# EAGLE board untitled (EAGLE 7.2.0), part 1 of 2
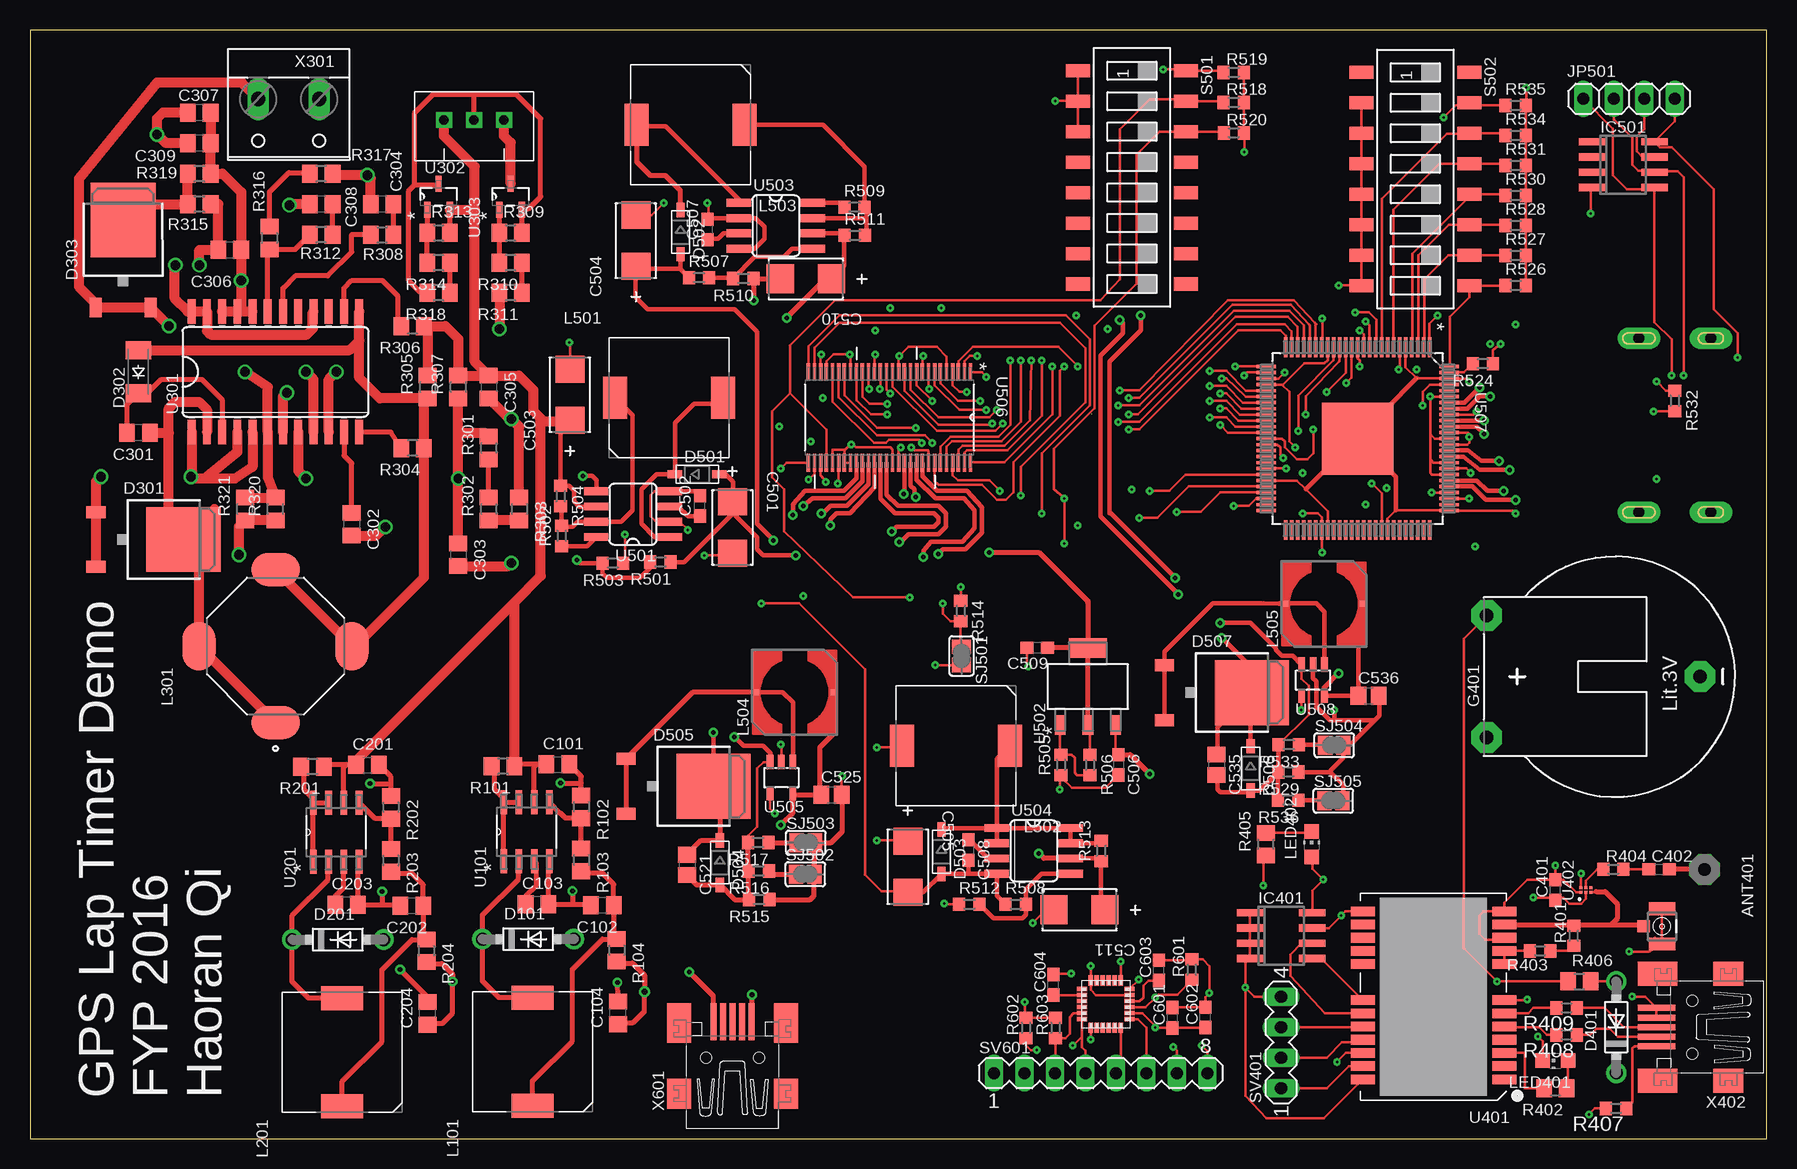
[diagram p8: board, top side]
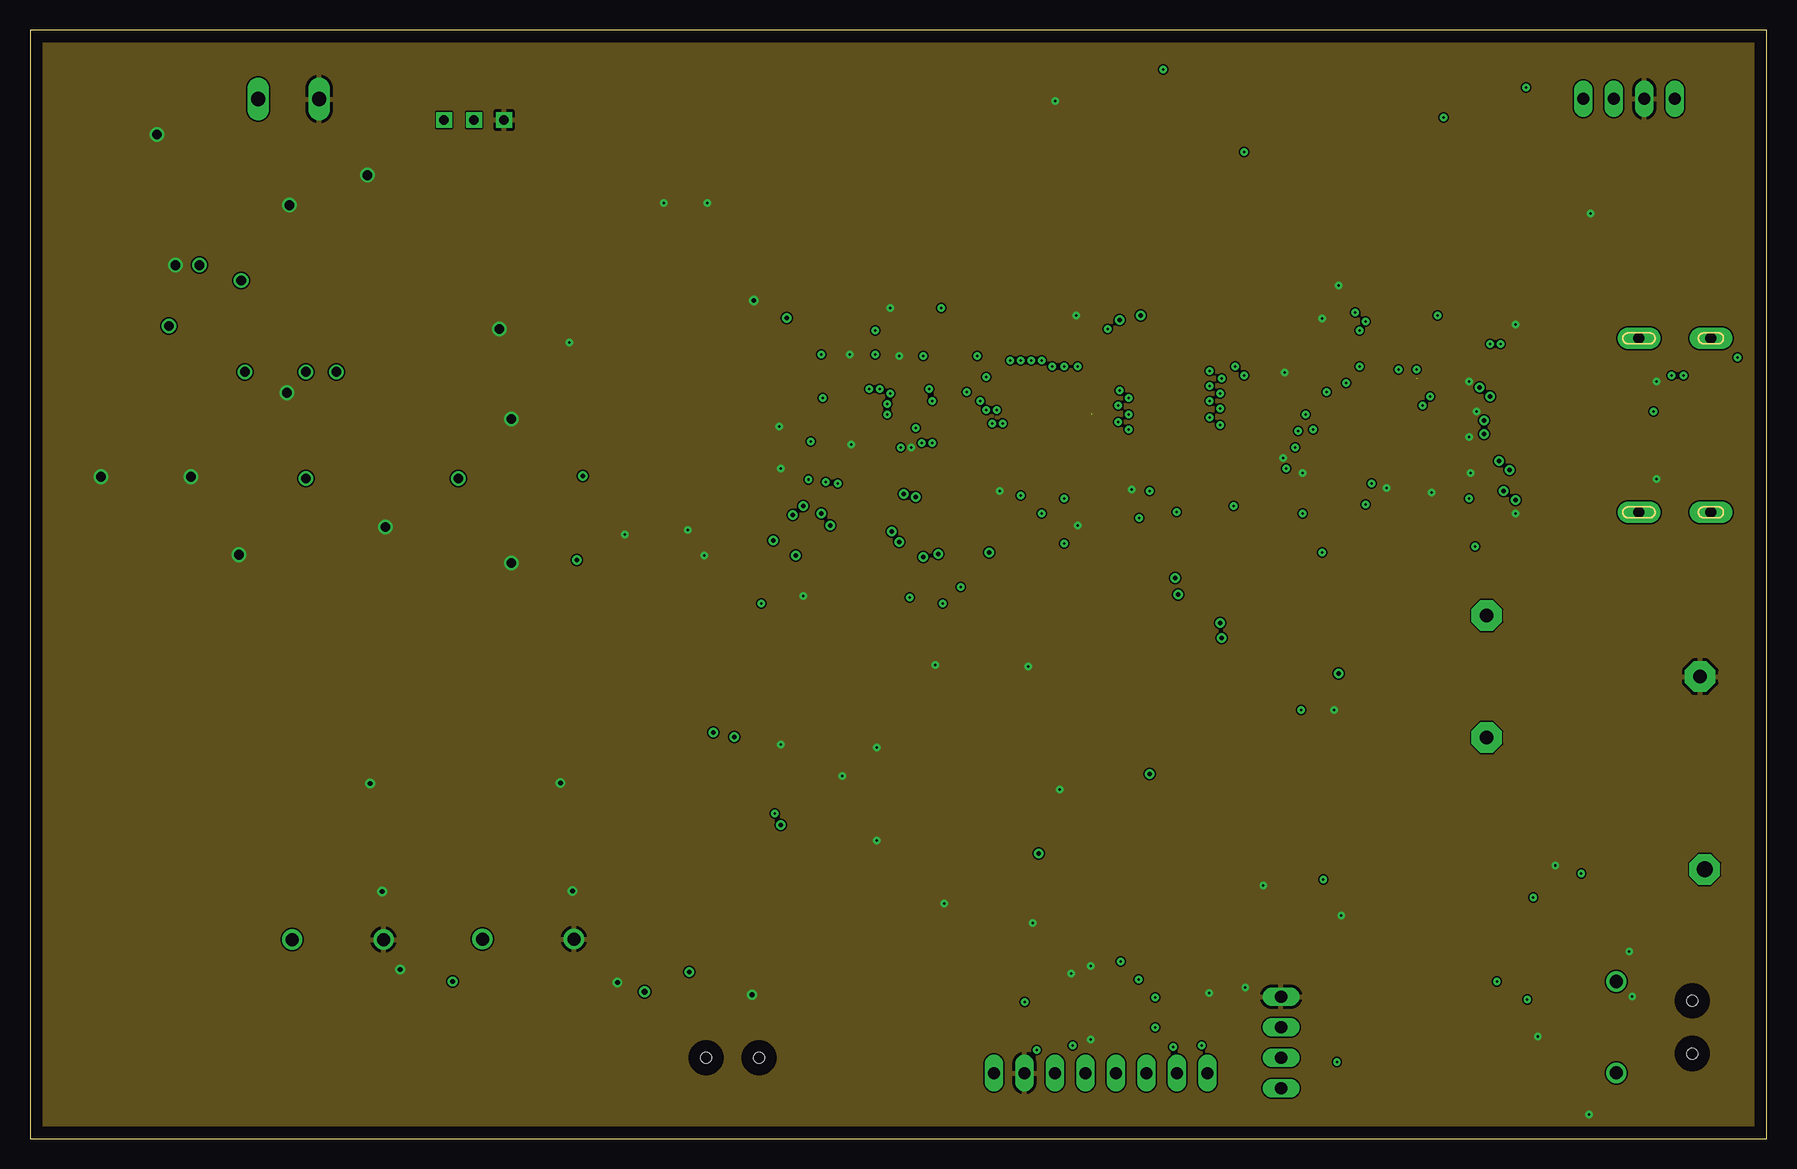
[diagram p9: board, inner layer Route2]
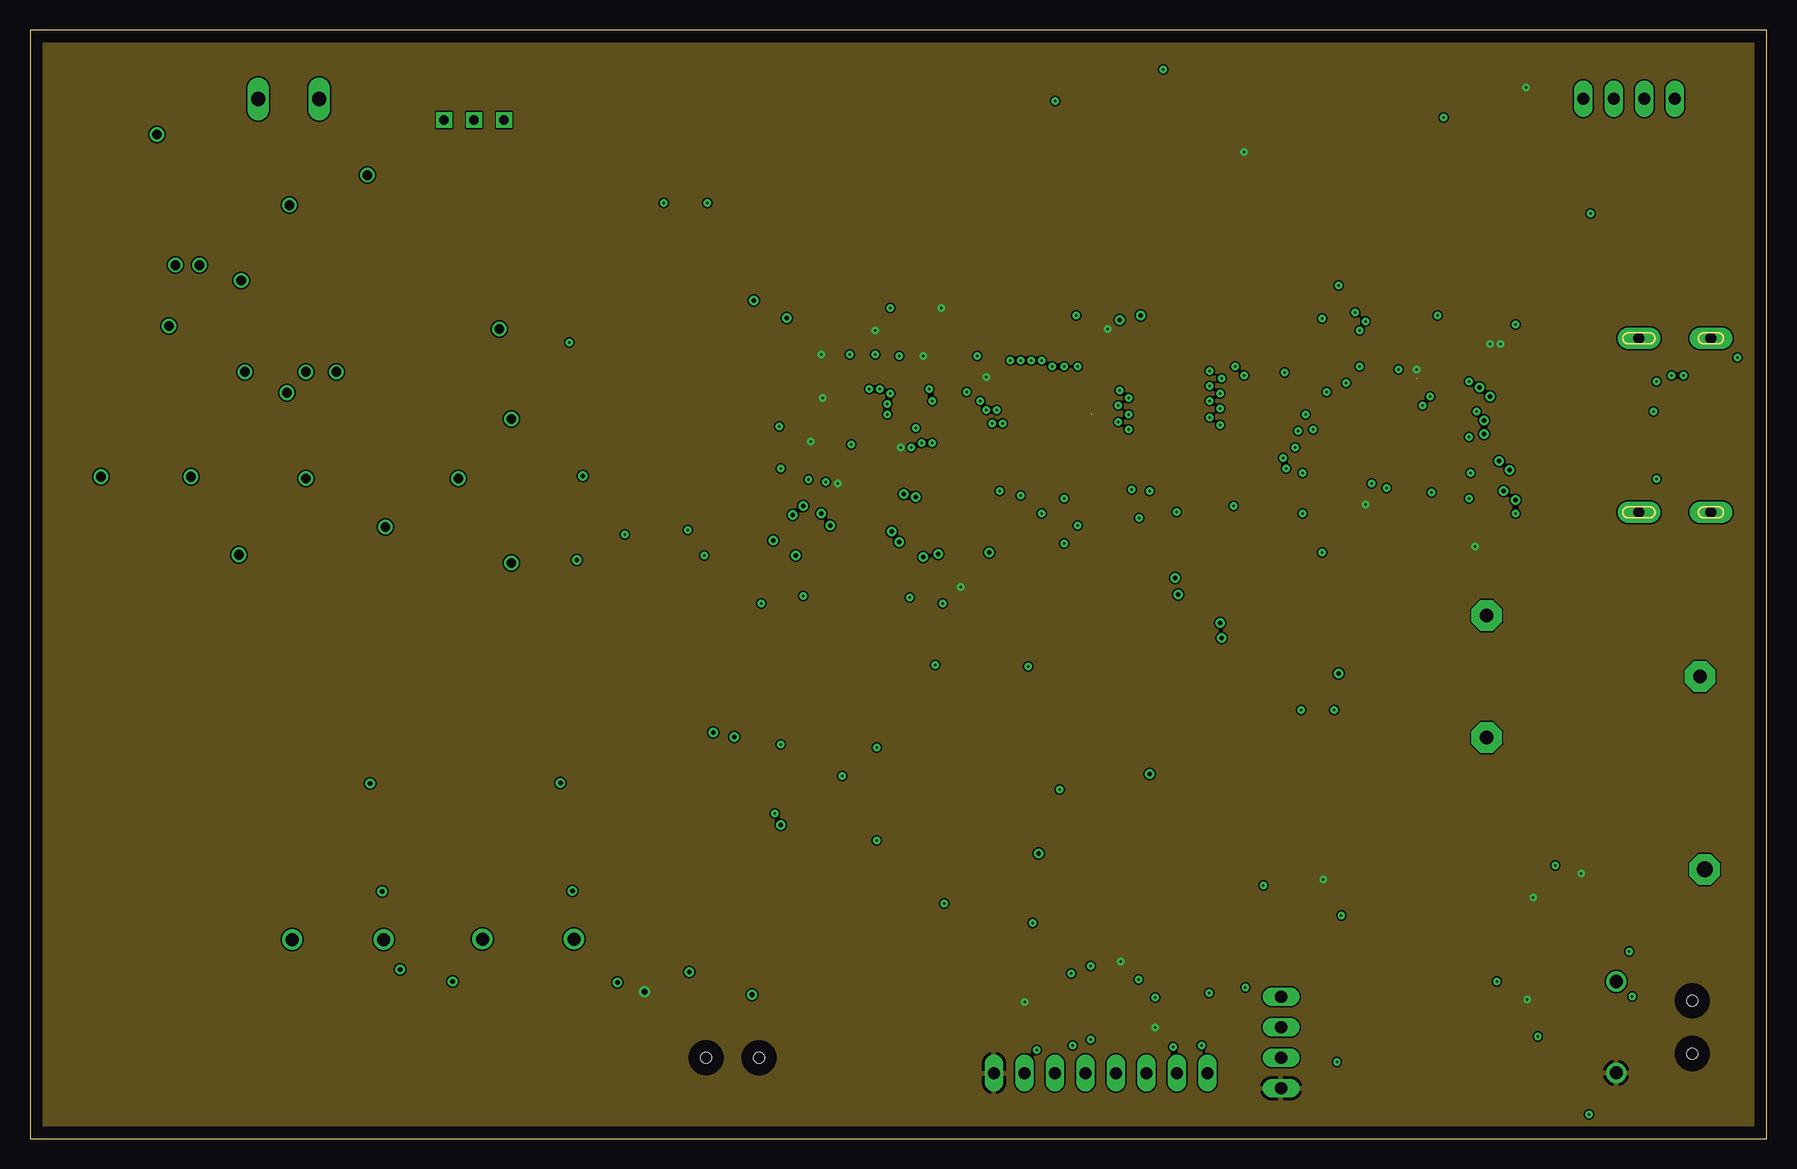
[diagram p10: board, inner layer Route15]
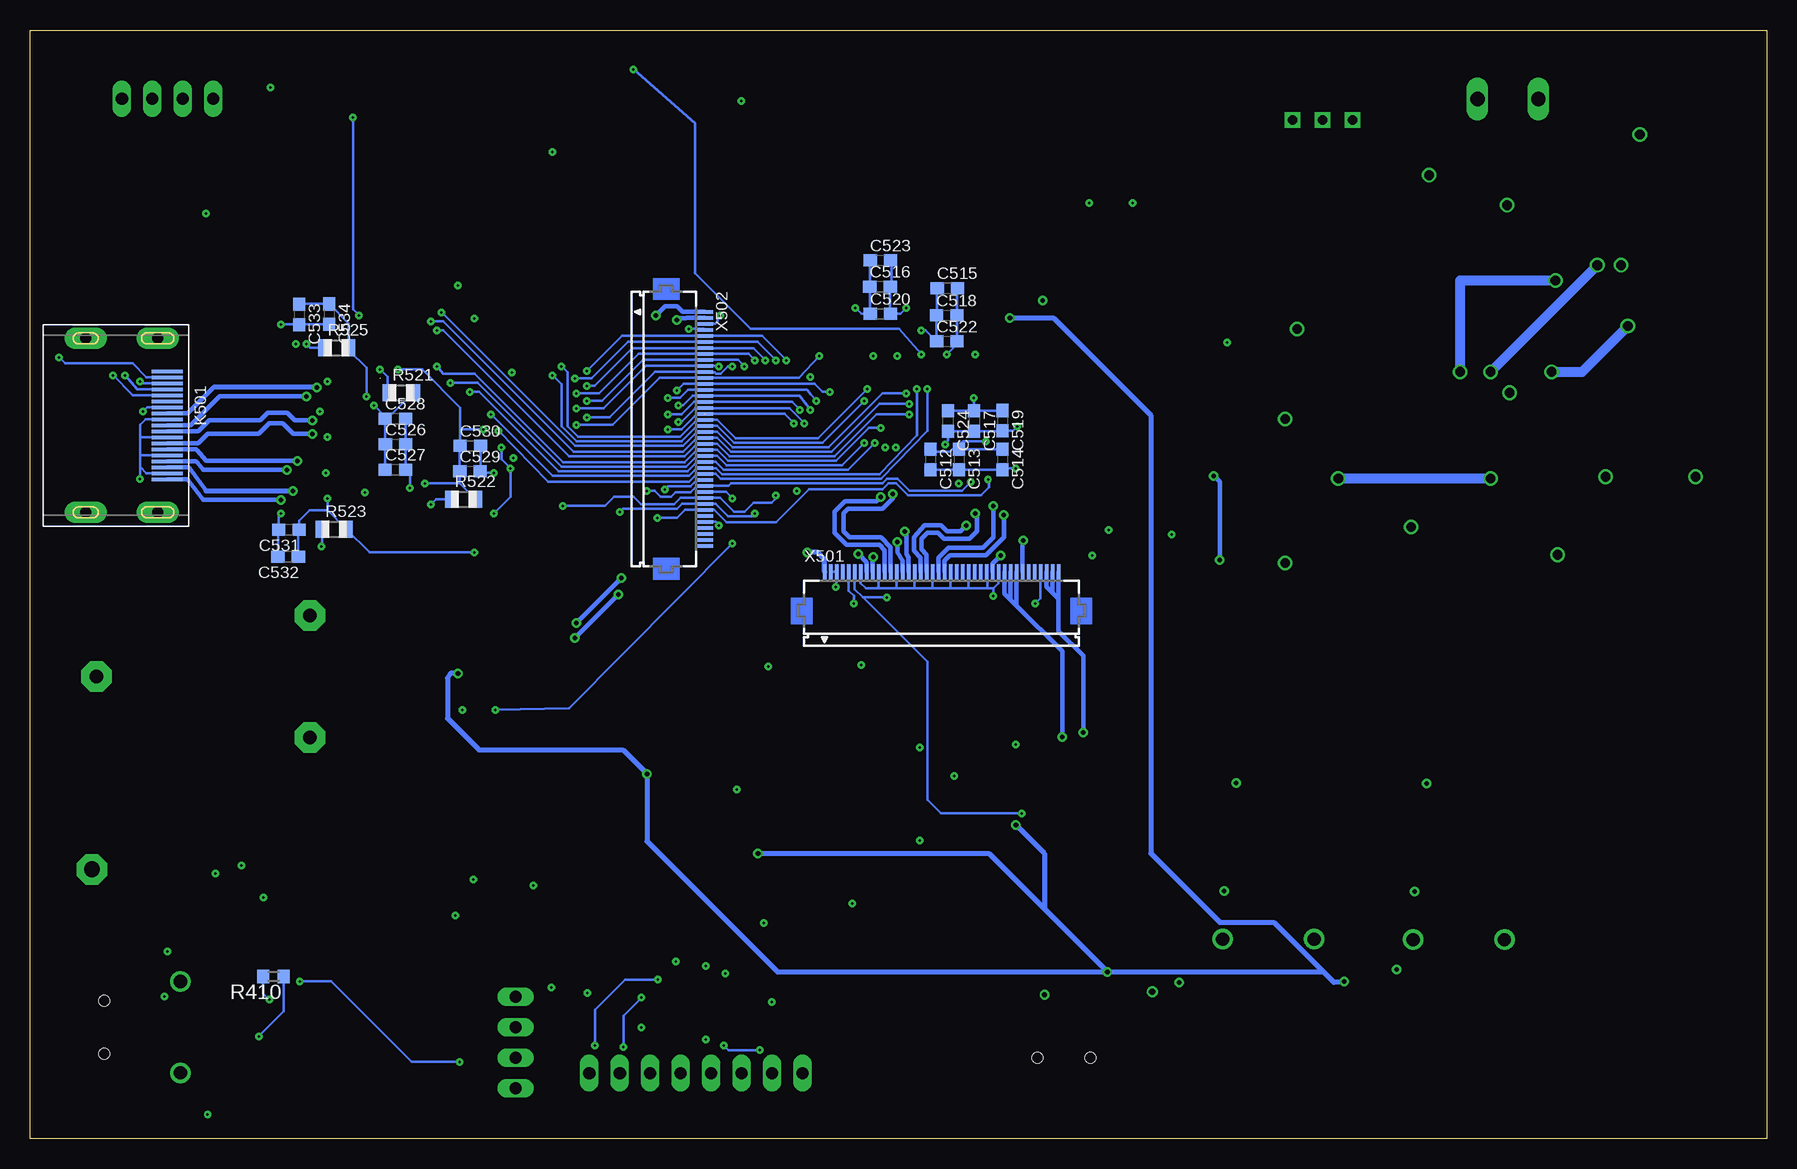
[diagram p11: board, bottom side, seen from below]

Size 144.76 x 92.38 mm. Coordinates in mm from the lower left corner, seen from the top.
Outline: 0,0 144.76,0 144.76,92.38 0,92.38 0,0
Copper layers (1+2*15+16): Top 0.035mm / dielectric 0.22mm / Route2 0.035mm / dielectric 0.99mm / Route15 0.035mm / dielectric 0.22mm / Bottom 0.035mm
Design rules "default *": minimum track width 0.125mm, minimum drill 0.2mm, track to track 0.125mm, track to pad 0.125mm, pad to pad 0.125mm, via to via 0.125mm, smd to smd 0.125mm, copper to edge 40mil, drill to drill 8mil, minimum pad ring 10mil, minimum via ring 8mil, stop-mask expansion 4mil, vias tented up to drill 0mil, thermal gap 10mil
Net classes: 1 power1: width 0.813 mm, drill 0.813 mm, clearance 0.125 mm

## Footprints (pad centres in the part's own frame; a part is rotated, then mirrored left to right if it is on the bottom)
PAD-01 = drill 1.321 pad 2.54 octagon: 1 0,0
C0805 = smd 1.3 x 1.5: 1 -0.95,0; 2 0.95,0
C0603 = smd 1.1 x 1: 1 -0.85,0; 2 0.85,0
CAPCP6032X280N = smd 2.261 x 2.413: 1 -2.134,0; 2 2.134,0
C0805' = smd 1.3 x 1.5: 1 -0.85,0; 2 0.85,0
DO41-7.6 = drill 1.1 pad 1.7: A 3.81,0; C -3.81,0
DPACK = smd 1 x 1.6: 1 -2.28,-4.8; 3 2.28,-4.8 | smd 5.4 x 6.2: 2 0,2.5
SOD-123_MINI-SMA = smd 1.5 x 2.1: A 1.8,0; C -1.8,0
SOD-123 = smd 1.2 x 0.7: A 1.85,0; C -1.85,0
CR2032H = drill 1.118 pad 2.54 octagon: + 5.08,10.795; +@1 -5.08,10.795; - 0,-6.985
SO-08 = smd 0.6 x 2.2: 1 -1.905,-2.6; 2 -0.635,-2.6; 3 0.635,-2.6; 4 1.905,-2.6; 5 1.905,2.6; 6 0.635,2.6; 7 -0.635,2.6; 8 -1.905,2.6
3_PIN_JST-XH = drill 0.8 square: P$1 2.45,3.4; P$2 4.95,3.4; P$3 7.45,3.4
1X04 = drill 1.016 long: 1 -3.81,0; 2 -1.27,0; 3 1.27,0; 4 3.81,0
685119134923 = smd 0.28 x 2.6: 1 4.5,0; 2 4,0; 3 3.5,0; 4 3,0; 5 2.5,0; 6 2,0; 7 1.5,0; 8 1,0; 9 0.5,0; 10 0,0; 11 -0.5,0; 12 -1,0; 13 -1.5,0; 14 -2,0; 15 -2.5,0; 16 -3,0; 17 -3.5,0; 18 -4,0; 19 -4.5,0 | drill 0.9 pad 1.778 long: Z1 -7.25,-0.8; Z2 -7.25,-6.8; Z3 7.25,-6.8; Z4 7.25,-0.8
WE-PD_1030/1050 = smd 2 x 3.5: 1 -4.5,0; 2 4.5,0
INDM115115X635N = smd 2.769 x 4.064: 1 -6.375,0; 3 6.375,0 | smd 4.064 x 2.769: 2 0,-6.375; 4 0,6.375
MSS7341 = smd 0.5 x 0.5: 1 0,3.225; 2 0,-3.225
CHIP-LED0805 = smd 1.2 x 1.2: A 0,-1.05; C 0,1.05
R0805 = smd 1.3 x 1.5: 1 -0.95,0; 2 0.95,0
R0603 = smd 1 x 1.1: 1 -0.85,0; 2 0.85,0
R0805' = smd 1.1 x 1.4: 1 -1,0; 2 1,0
SMS-008 = smd 1.092 x 2.007: 1 -8.89,-4.496; 2 -6.35,-4.496; 3 -3.81,-4.496; 4 -1.27,-4.496; 5 1.27,-4.496; 6 3.81,-4.496; 7 6.35,-4.496; 8 8.89,-4.496; 9 8.89,4.496; 10 6.35,4.496; 11 3.81,4.496; 12 1.27,4.496; 13 -1.27,4.496; 14 -3.81,4.496; 15 -6.35,4.496; 16 -8.89,4.496
SJ = smd 1.168 x 1.6: 1 -0.762,0; 2 0.762,0
MA04-1 = drill 1.016 long: 1 -3.81,0; 2 -1.27,0; 3 1.27,0; 4 3.81,0
MA08-1 = drill 1.016 long: 1 -8.89,0; 2 -6.35,0; 3 -3.81,0; 4 -1.27,0; 5 1.27,0; 6 3.81,0; 7 6.35,0; 8 8.89,0
SOIC127P600X175-8N = smd 1.981 x 0.559: 1 -2.464,1.905; 2 -2.464,0.635; 3 -2.464,-0.635; 4 -2.464,-1.905; 5 2.464,-1.905; 6 2.464,-0.635; 7 2.464,0.635; 8 2.464,1.905
SO24W = smd 0.66 x 2.032: 1 -6.985,-5.029; 2 -5.715,-5.029; 3 -4.445,-5.029; 4 -3.175,-5.029; 5 -1.905,-5.029; 6 -0.635,-5.029; 7 0.635,-5.029; 8 1.905,-5.029; 9 3.175,-5.029; 10 4.445,-5.029; 11 5.715,-5.029; 12 6.985,-5.029; 13 6.985,5.029; 14 5.715,5.029; 15 4.445,5.029; 16 3.175,5.029; 17 1.905,5.029; 18 0.635,5.029; 19 -0.635,5.029; 20 -1.905,5.029; 21 -3.175,5.029; 22 -4.445,5.029; 23 -5.715,5.029; 24 -6.985,5.029
SOT95P237X112-3N = smd 1.321 x 0.559: 1 -1.092,0.94; 2 -1.092,-0.94 | smd 1.321 x 0.508: 3 1.092,0
GPS24P-SMD-1.1-16X12.2MM = smd 2 x 0.8: 1 -5.904,6.888; 2 -5.904,5.788; 3 -5.904,4.688; 4 -5.904,3.588; 5 -5.904,2.488; 6 -5.904,1.388; 7 -5.904,0.288; 8 -5.904,-2.712; 9 -5.904,-3.812; 10 -5.904,-4.912; 11 -5.904,-6.012; 12 -5.904,-7.112; 13 5.896,-7.112; 14 5.896,-6.012; 15 5.896,-4.912; 16 5.896,-3.812; 17 5.896,-2.712; 18 5.896,0.288; 19 5.896,1.388; 20 5.896,2.488; 21 5.896,3.588; 22 5.896,4.688; 23 5.896,5.788; 24 5.896,6.888
INF-TSLP-6-2_V_1PRIMARY = smd 0.25 x 0.25: 1 -0.2,0.4; 2 -0.2,0; 3 -0.2,-0.4; 4 0.2,-0.4; 5 0.2,0; 6 0.2,0.4
SO08 = smd 0.66 x 2.032: 1 -1.905,-3.073; 2 -0.635,-3.073; 3 0.635,-3.073; 4 1.905,-3.073; 5 1.905,3.073; 6 0.635,3.073; 7 -0.635,3.073; 8 -1.905,3.073
SOT230P700X180-4N = smd 1.626 x 0.889: 1 -3.2,2.311; 2 -3.2,0; 3 -3.2,-2.311 | smd 1.626 x 3.175: 4 3.2,0
SOT23-5L = smd 0.55 x 1.2: 1 -0.95,-1.3; 2 0,-1.3; 3 0.95,-1.3; 4 0.95,1.3; 5 -0.95,1.3
SOP50P810X120-56N = smd 1.473 x 0.279: 1 -3.785,6.756; 2 -3.785,6.248; 3 -3.785,5.74; 4 -3.785,5.258; 5 -3.785,4.75; 6 -3.785,4.242; 7 -3.785,3.759; 8 -3.785,3.251; 9 -3.785,2.743; 10 -3.785,2.261; 11 -3.785,1.753; 12 -3.785,1.245; 13 -3.785,0.762; 14 -3.785,0.254; 15 -3.785,-0.254; 16 -3.785,-0.762; 17 -3.785,-1.245; 18 -3.785,-1.753; 19 -3.785,-2.261; 20 -3.785,-2.743; 21 -3.785,-3.251; 22 -3.785,-3.759; 23 -3.785,-4.242; 24 -3.785,-4.75; 25 -3.785,-5.258; 26 -3.785,-5.74; 27 -3.785,-6.248; 28 -3.785,-6.756; 29 3.785,-6.756; 30 3.785,-6.248; 31 3.785,-5.74; 32 3.785,-5.258; 33 3.785,-4.75; 34 3.785,-4.242; 35 3.785,-3.759; 36 3.785,-3.251; 37 3.785,-2.743; 38 3.785,-2.261; 39 3.785,-1.753; 40 3.785,-1.245; 41 3.785,-0.762; 42 3.785,-0.254; 43 3.785,0.254; 44 3.785,0.762; 45 3.785,1.245; 46 3.785,1.753; 47 3.785,2.261; 48 3.785,2.743; 49 3.785,3.251; 50 3.785,3.759; 51 3.785,4.242; 52 3.785,4.75; 53 3.785,5.258; 54 3.785,5.74; 55 3.785,6.248; 56 3.785,6.756
QFP50P1600X1600X120-101N = smd 1.651 x 0.279: 1 -7.62,5.994; 2 -7.62,5.512; 3 -7.62,5.004; 4 -7.62,4.496; 5 -7.62,3.988; 6 -7.62,3.505; 7 -7.62,2.997; 8 -7.62,2.489; 9 -7.62,2.007; 10 -7.62,1.499; 11 -7.62,0.991; 12 -7.62,0.508; 13 -7.62,0; 14 -7.62,-0.508; 15 -7.62,-0.991; 16 -7.62,-1.499; 17 -7.62,-2.007; 18 -7.62,-2.489; 19 -7.62,-2.997; 20 -7.62,-3.505; 21 -7.62,-3.988; 22 -7.62,-4.496; 23 -7.62,-5.004; 24 -7.62,-5.512; 25 -7.62,-5.994; 51 7.62,-5.994; 52 7.62,-5.512; 53 7.62,-5.004; 54 7.62,-4.496; 55 7.62,-3.988; 56 7.62,-3.505; 57 7.62,-2.997; 58 7.62,-2.489; 59 7.62,-2.007; 60 7.62,-1.499; 61 7.62,-0.991; 62 7.62,-0.508; 63 7.62,0; 64 7.62,0.508; 65 7.62,0.991; 66 7.62,1.499; 67 7.62,2.007; 68 7.62,2.489; 69 7.62,2.997; 70 7.62,3.505; 71 7.62,3.988; 72 7.62,4.496; 73 7.62,5.004; 74 7.62,5.512; 75 7.62,5.994 | smd 0.279 x 1.651: 26 -5.994,-7.62; 27 -5.512,-7.62; 28 -5.004,-7.62; 29 -4.496,-7.62; 30 -3.988,-7.62; 31 -3.505,-7.62; 32 -2.997,-7.62; 33 -2.489,-7.62; 34 -2.007,-7.62; 35 -1.499,-7.62; 36 -0.991,-7.62; 37 -0.508,-7.62; 38 0,-7.62; 39 0.508,-7.62; 40 0.991,-7.62; 41 1.499,-7.62; 42 2.007,-7.62; 43 2.489,-7.62; 44 2.997,-7.62; 45 3.505,-7.62; 46 3.988,-7.62; 47 4.496,-7.62; 48 5.004,-7.62; 49 5.512,-7.62; 50 5.994,-7.62; 76 5.994,7.62; 77 5.512,7.62; 78 5.004,7.62; 79 4.496,7.62; 80 3.988,7.62; 81 3.505,7.62; 82 2.997,7.62; 83 2.489,7.62; 84 2.007,7.62; 85 1.499,7.62; 86 0.991,7.62; 87 0.508,7.62; 88 0,7.62; 89 -0.508,7.62; 90 -0.991,7.62; 91 -1.499,7.62; 92 -2.007,7.62; 93 -2.489,7.62; 94 -2.997,7.62; 95 -3.505,7.62; 96 -3.988,7.62; 97 -4.496,7.62; 98 -5.004,7.62; 99 -5.512,7.62; 100 -5.994,7.62 | smd 5.994 x 5.994: 101 0,0
QFN.24.4X4 = smd 0.85 x 0.38: 1 -1.975,1.25; 2 -1.975,0.75; 3 -1.975,0.25; 4 -1.975,-0.25; 5 -1.975,-0.75; 6 -1.975,-1.25; 13 1.975,-1.25; 14 1.975,-0.75; 15 1.975,-0.25; 16 1.975,0.25; 17 1.975,0.75; 18 1.975,1.25 | smd 0.38 x 0.85: 7 -1.25,-1.975; 8 -0.75,-1.975; 9 -0.25,-1.975; 10 0.25,-1.975; 11 0.75,-1.975; 12 1.25,-1.975; 19 1.25,1.975; 20 0.75,1.975; 21 0.25,1.975; 22 -0.25,1.975; 23 -0.75,1.975; 24 -1.25,1.975
W237-132 = drill 1.194 long: 1 -2.54,-0.635; 2 2.54,-0.635
MC-921 = smd 1 x 1.05: 1 0,1.528 | smd 1.05 x 2.2: 2@1 -1.475,0; 2@2 1.475,0
32005-301 = smd 3.1 x 0.5: 1 3,1.6; 2 3,0.8; 3 3,0; 4 3,-0.8; 5 3,-1.6 | smd 2.5 x 2: M1 -3,-4.45; M2 -3,4.45 | smd 3.3 x 2: M3 2.9,4.45; M4 2.9,-4.45 | hole 0.9: 0,2.2; 0,-2.2
FH12-40S-0.5SH = smd 0.3 x 1.3: 1 -9.75,3.25; 2 -9.25,3.25; 3 -8.75,3.25; 4 -8.25,3.25; 5 -7.75,3.25; 6 -7.25,3.25; 7 -6.75,3.25; 8 -6.25,3.25; 9 -5.75,3.25; 10 -5.25,3.25; 11 -4.75,3.25; 12 -4.25,3.25; 13 -3.75,3.25; 14 -3.25,3.25; 15 -2.75,3.25; 16 -2.25,3.25; 17 -1.75,3.25; 18 -1.25,3.25; 19 -0.75,3.25; 20 -0.25,3.25; 21 0.25,3.25; 22 0.75,3.25; 23 1.25,3.25; 24 1.75,3.25; 25 2.25,3.25; 26 2.75,3.25; 27 3.25,3.25; 28 3.75,3.25; 29 4.25,3.25; 30 4.75,3.25; 31 5.25,3.25; 32 5.75,3.25; 33 6.25,3.25; 34 6.75,3.25; 35 7.25,3.25; 36 7.75,3.25; 37 8.25,3.25; 38 8.75,3.25; 39 9.25,3.25; 40 9.75,3.25

## Placement (x,y rotation side)
ANT401  [PAD-01]  139.59,22.43 270 top
C101  100u  [C0805]  44,31.17 0 top
C102  470u  [C0805]  47.7,19.42 180 top
C103  470p  [C0805]  42.27,19.53 0 top
C104  100uF  [C0805]  49.02,10.47 90 top
C201  100u  [C0805]  28.13,31.13 0 top
C202  470u  [C0805]  31.84,19.38 180 top
C203  470p  [C0805]  26.39,19.49 0 top
C204  100uF  [C0805]  33.14,10.44 90 top
C301  0.47uF  [C0805]  9.03,58.82 180 top
C302  200pF  [C0805]  26.81,51.2 270 top
C303  50pF  [C0805]  35.7,48.66 270 top
C304  0.33uF  [C0805]  29.35,77.87 180 top
C305  22uF  [C0805]  38.25,62.62 270 top
C306  1uF  [C0805]  16.66,74.06 0 top
C307  10uF  [C0805]  14.11,85.48 180 top
C308  1uF  [C0805]  24.27,77.87 180 top
C309  10uF  [C0805]  14.11,82.95 180 top
C401  1uF  [C0603]  127.14,20.71 90 top
C402  1nF  [C0603]  135.79,22.43 0 top
C501  47µF  [CAPCP6032X280N]  58.55,50.92 270 top
C502  470pF  [C0603]  55.84,52.73 90 top
C503  100µF  [CAPCP6032X280N]  45,61.98 90 top
C504  4.7µF  [CAPCP6032X280N]  50.5,74.83 90 top
C505  4.7µF  [CAPCP6032X280N]  73.17,22.65 270 top
C506  0.1uF  [C0603]  90.72,31.14 270 top
C507  470pF  [C0603]  56.47,75.75 90 top
C508  470pF  [C0603]  78.22,24.04 270 top
C509  1uF  [C0603]  83.97,40.89 180 top
C510  100µF  [CAPCP6032X280N]  64.68,71.64 180 top
C511  100µF  [CAPCP6032X280N]  87.47,19.06 180 top
C512  0.01uF  [C0603]  69.72,56.59 270 bottom
C513  0.1uF  [C0603]  67.34,56.59 270 bottom
C514  1uF  [C0603]  63.72,56.59 270 bottom
C515  0.01uF  [C0603]  68.29,70.87 0 bottom
C516  0.01uF  [C0603]  73.91,71 0 bottom
C517  0.01uF  [C0603]  66.06,59.79 270 bottom
C518  0.1uF  [C0603]  68.34,68.59 0 bottom
C519  0.1uF  [C0603]  63.72,59.82 270 bottom
C520  0.1uF  [C0603]  73.87,68.72 0 bottom
C521  2.2uF  [C0805']  54.77,22.8 270 top
C522  1uF  [C0603]  68.33,66.43 0 bottom
C523  1uF  [C0603]  73.88,73.18 0 bottom
C524  1uF  [C0603]  68.26,59.8 270 bottom
C525  10uF  [C0805']  66.8,28.64 0 top
C526  22uF  [C0603]  114.29,57.84 0 bottom
C527  0.01uF  [C0603]  114.3,55.74 0 bottom
C528  0.01uF  [C0603]  114.3,59.99 0 bottom
C529  22uF  [C0603]  108.08,55.59 0 bottom
C530  0.01uF  [C0603]  108.06,57.72 0 bottom
C531  22uF  [C0603]  123.17,50.72 180 bottom
C532  0.01uF  [C0603]  123.24,48.47 180 bottom
C533  22uF  [C0603]  122.34,68.68 270 bottom
C534  0.01uF  [C0603]  119.84,68.7 270 bottom
C535  2.2uF  [C0805']  98.89,31.16 270 top
C536  10uF  [C0805']  111.58,36.89 0 top
C601  0.01uF  [C0603]  95.23,10.06 90 top
C602  0.1uF  [C0603]  97.97,10.1 90 top
C603  0.1uF  [C0603]  94.09,14.02 90 top
C604  2.2nF  [C0603]  85.3,12.81 90 top
D101  1N5819-T  [DO41-7.6]  41.53,16.62 0 top
D201  1N5819-T  [DO41-7.6]  25.66,16.58 0 top
D301  MBRD340  [DPACK]  10.3,49.93 270 top
D302  MBR0540T  [SOD-123_MINI-SMA]  9.03,63.9 90 top
D303  MBRD340  [DPACK]  7.77,74.06 0 top
D401  1N5817-B  [DO41-7.6]  132.23,9.28 90 top
D501  [SOD-123]  55.61,55.36 0 top
D502  [SOD-123]  54.23,75.55 270 top
D503  [SOD-123]  75.98,23.89 270 top
D504  MMSZ11T1G  [SOD-123]  57.5,22.99 270 top
D505  MBRD340  [DPACK]  54.47,29.35 270 top
D506  MMSZ24T1G  [SOD-123]  101.75,30.84 270 top
D507  MBRD340  [DPACK]  99.35,37.16 270 top
G401  CR2032H  [CR2032H]  132.23,38.49 90 top
IC401  24AA32ASN  [SO-08]  104.29,16.91 270 top
IC501  24C16BSN  [SO-08]  132.8,81.16 270 top
J301  3_PIN_JST-XH  [3_PIN_JST-XH]  32.06,81.48 0 top
JP501  [1X04]  133.29,86.65 0 top
K501  685119134923  [685119134923]  133.31,59.43 270 bottom
L101  [WE-PD_1030/1050]  41.89,7.24 90 top
L201  [WE-PD_1030/1050]  26.02,7.21 90 top
L301  19.6µH  [INDM115115X635N]  20.46,41.03 90 top
L501  [WE-PD_1030/1050]  53.26,61.72 0 top
L502  [WE-PD_1030/1050]  77.18,32.72 180 top
L503  [WE-PD_1030/1050]  55.06,84.47 180 top
L504  MSS7341  [MSS7341]  63.73,37.19 90 top
L505  MSS7341  [MSS7341]  107.86,44.55 90 top
LED401  [CHIP-LED0805]  127.14,6.49 90 top
LED402  [CHIP-LED0805]  106.83,24.52 0 top
R101  0.2  [R0805]  39.42,31.03 180 top
R102  1k  [R0805]  45.95,27.64 270 top
R103  3k  [R0805]  45.95,23.23 270 top
R104  1uH  [R0805]  48.91,15.69 270 top
R201  0.2  [R0805]  23.55,30.99 180 top
R202  11k  [R0805]  30.09,27.6 270 top
R203  18k  [R0805]  30.09,23.18 270 top
R204  1uH  [R0805]  33.05,15.65 270 top
R301  150k  [R0805]  38.25,57.54 90 top
R302  10k  [R0805]  38.25,52.46 90 top
R303  2.2k  [R0805]  40.78,52.46 270 top
R304  100  [R0805]  31.89,57.54 180 top
R305  0.033  [R0805]  33.16,62.62 90 top
R306  100  [R0805]  31.89,67.7 180 top
R307  390k  [R0805]  35.7,62.62 90 top
R308  1k  [R0805]  29.35,75.33 0 top
R309  470k  [R0805]  40.06,75.48 0 top
R310  100k  [R0805]  40.06,72.98 180 top
R311  220k  [R0805]  40.06,70.48 180 top
R312  330  [R0805]  24.27,75.33 180 top
R313  470k  [R0805]  34.06,75.48 0 top
R314  220k  [R0805]  34.06,72.98 180 top
R315  470  [R0805]  14.11,77.87 180 top
R316  4.7k  [R0805]  19.96,75.06 270 top
R317  470  [R0805]  24.27,80.41 180 top
R318  100k  [R0805]  34.06,70.48 180 top
R319  0.033  [R0805]  14.11,80.41 180 top
R320  10k  [R0805]  20.46,52.46 90 top
R321  10k  [R0805]  17.92,52.46 90 top
R401  22uH  [R0603]  128.69,16.91 90 top
R402  1k  [R0805]  127.14,4.21 180 top
R403  22  [R0603]  125.87,15.63 180 top
R404  7.5nH  [R0603]  131.98,22.43 0 top
R405  1k  [R0805]  103.02,24.52 90 top
R406  1k  [R0805]  129.14,13.1 0 top
R407  4.7k  [R0603]  132.2,2.51 180 top
R408  22  [R0603]  128.08,8.63 180 top
R409  22  [R0603]  128.08,10.88 180 top
R410  10k  [R0603]  124.45,13.51 180 bottom
R501  8.2k  [R0603]  52.55,48.04 180 top
R502  180  [R0603]  44.31,50.22 90 top
R503  1k  [R0603]  48.59,47.95 180 top
R504  1  [R0603]  44.24,53.54 270 top
R505  240  [R0603]  85.94,31.14 90 top
R506  120  [R0603]  88.36,31.13 270 top
R507  15k  [R0603]  55.77,71.75 0 top
R508  2.7k  [R0603]  82.17,19.52 0 top
R509  180  [R0603]  68.72,77.62 0 top
R510  1k  [R0603]  59.47,71.67 180 top
R511  1  [R0603]  68.76,75.27 0 top
R512  12k  [R0603]  78.3,19.52 0 top
R513  1  [R0603]  89.29,23.98 90 top
R514  4.7k  [R0603]  77.59,43.97 270 top
R515  5.1  [R0603]  60.78,19.92 180 top
R516  9.1  [R0603]  60.74,22.29 180 top
R517  10  [R0603]  60.69,24.67 180 top
R518  4.7k  [R0603]  100.34,86.34 0 top
R519  4.7k  [R0603]  100.34,88.84 0 top
R520  4.7k  [R0603]  100.35,83.8 0 top
R521  [R0805']  113.81,62.15 0 bottom
R522  [R0805']  108.61,53.28 0 bottom
R523  [R0805']  119.4,50.78 0 bottom
R524  4.7k  [R0603]  121.1,64.58 180 top
R525  [R0805']  119.2,65.91 0 bottom
R526  4.7k  [R0603]  123.84,71.09 0 top
R527  4.7k  [R0603]  123.84,73.59 0 top
R528  4.7k  [R0603]  123.84,76.09 0 top
R529  5.1  [R0603]  104.9,30.54 180 top
R530  4.7k  [R0603]  123.84,78.59 0 top
R531  4.7k  [R0603]  123.84,81.09 0 top
R532  75  [R0603]  137.12,61.48 270 top
R533  10  [R0603]  104.93,32.82 180 top
R534  4.7k  [R0603]  123.84,83.59 0 top
R535  4.7k  [R0603]  123.84,86.09 0 top
R536  10  [R0603]  104.89,28.2 180 top
R601  4.7k  [R0603]  96.85,14.08 90 top
R602  4.7k  [R0603]  83.03,9.22 90 top
R603  4.7k  [R0603]  85.49,9.22 90 top
S501  SWS008  [SMS-008]  91.85,80.1 270 top
S502  SWS008  [SMS-008]  115.48,79.96 270 top
SJ501  [SJ]  77.65,40.23 270 top
SJ502  [SJ]  64.63,22.03 0 top
SJ503  [SJ]  64.67,24.66 0 top
SJ504  [SJ]  108.72,32.78 0 top
SJ505  [SJ]  108.64,28.16 0 top
SV401  [MA04-1]  104.29,8.01 90 top
SV601  [MA08-1]  89.25,5.46 0 top
U101  MC34063ADE4  [SOIC127P600X175-8N]  41.39,25.56 90 top
U201  MC34063ADE4  [SOIC127P600X175-8N]  25.52,25.52 90 top
U301  LT1511  [SO24W]  20.46,63.9 0 top
U302  TL431BQDBZR  [SOT95P237X112-3N]  34.06,78.48 90 top
U303  TL431BQDBZR  [SOT95P237X112-3N]  40.06,78.48 90 top
U401  MOUDLE-GPS-NEO-6M(24P-16X12.2MM)  [GPS24P-SMD-1.1-16X12.2MM]  116.98,11.83 180 top
U402  INF-TSLP-6-2_V_1  [INF-TSLP-6-2_V_1PRIMARY]  129.69,20.71 90 top
U501  MC33063/MC34063D  [SO08]  50.26,52.04 90 top
U502  LM317DCY  [SOT230P700X180-4N]  88.19,37.66 90 top
U503  MC33063/MC34063D  [SO08]  62.17,76.07 270 top
U504  MC33063/MC34063D  [SO08]  83.67,23.98 270 top
U505  FAN5333BSX  [SOT23-5L]  62.64,30.08 180 top
U506  SN75LVDS83BDGG  [SOP50P810X120-56N]  71.64,60.1 270 top
U507  TPF401  [QFP50P1600X1600X120-101N]  110.67,58.33 270 top
U508  FAN5333BSX  [SOT23-5L]  106.95,38.2 180 top
U601  MPU-6050  [QFN.24.4X4]  89.67,11.2 90 top
X301  [W237-132]  21.56,85.98 180 top
X401  MC-921  [MC-921]  136.04,17.67 90 top
X402  MINI-USB-32005-301  [32005-301]  138.57,9.28 180 top
X501  FH12-40S-0.5SH  [FH12-40S-0.5SH]  68.77,43.98 0 bottom
X502  FH12-40S-0.5SH  [FH12-40S-0.5SH]  91.72,59.13 270 bottom
X601  MINI-USB-32005-301  [32005-301]  58.56,6.74 90 top